# EAGLE design w10-output (EAGLE 8.4.0)
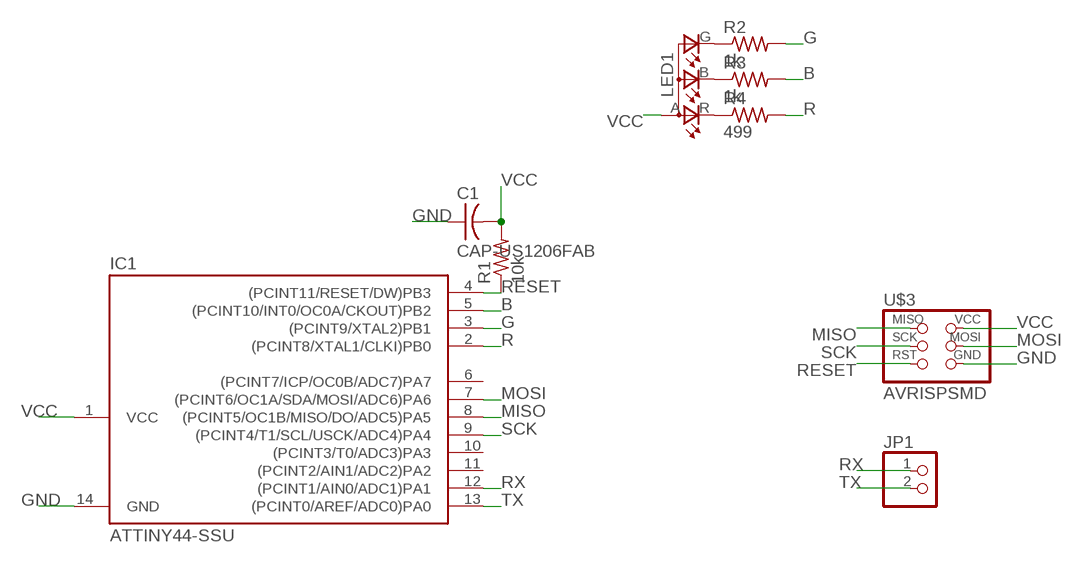
[diagram p0: schematic, sheet 1]

## Parts
C1  CAP-US1206FAB  [C1206FAB]
IC1  ATTINY44-SSU  [SOIC14]
JP1  PINHD-1X2  [1X02]
LED1  LEDRGBOLD  [P-LCC-4-3]
R1  10k  RES-US1206FAB  [R1206FAB]
R2  1k  RES-US1206FAB  [R1206FAB]
R3  1k  RES-US1206FAB  [R1206FAB]
R4  499  RES-US1206FAB  [R1206FAB]
U$3  AVRISPSMD  [2X03SMD]

## Nets
B: IC1.5((PCINT10/INT0/OC0A/CKOUT)PB2) R3.2
G: IC1.3((PCINT9/XTAL2)PB1) R2.2
GND: C1.1 IC1.14(GND) U$3.6(GND)
MISO: IC1.8((PCINT5/OC1B/MISO/DO/ADC5)PA5) U$3.1(MISO)
MOSI: IC1.7((PCINT6/OC1A/SDA/MOSI/ADC6)PA6) U$3.4(MOSI)
N$2: LED1.G(CGREEN) R2.1
N$6: LED1.B(CBLUE) R3.1
N$7: LED1.R(CRED) R4.1
R: IC1.2((PCINT8/XTAL1/CLKI)PB0) R4.2
RESET: IC1.4((PCINT11/RESET/DW)PB3) R1.1 U$3.5(RST)
RX: IC1.12((PCINT1/AIN0/ADC1)PA1) JP1.1
SCK: IC1.9((PCINT4/T1/SCL/USCK/ADC4)PA4) U$3.3(SCK)
TX: IC1.13((PCINT0/AREF/ADC0)PA0) JP1.2
VCC: C1.2 IC1.1(VCC) LED1.A(A2) R1.2 U$3.2(VCC)
Unconnected: IC1.6((PCINT7/ICP/OC0B/ADC7)PA7) IC1.10((PCINT3/T0/ADC3)PA3) IC1.11((PCINT2/AIN1/ADC2)PA2)

## Library data of the parts
C1 = fab:CAP-US
IC1 = fab:ATTINY44
JP1 = pinhead:PINHD-1X2: PIN HEADER
LED1 = fab:LEDRGBOLD: OSRAM Hyper Multi TOPLED® Hyper-Bright LED LATB T686 Source: http://www.osram.convergy.de/
R1-R4 = fab:RES-US: Resistor (US Symbol) Variants with postfix FAB are widened to allow the routing of internal traces
U$3 = fab:AVRISP

## Net classes
0 default: width 0.1 mm, clearance 0.5 mm

## Board
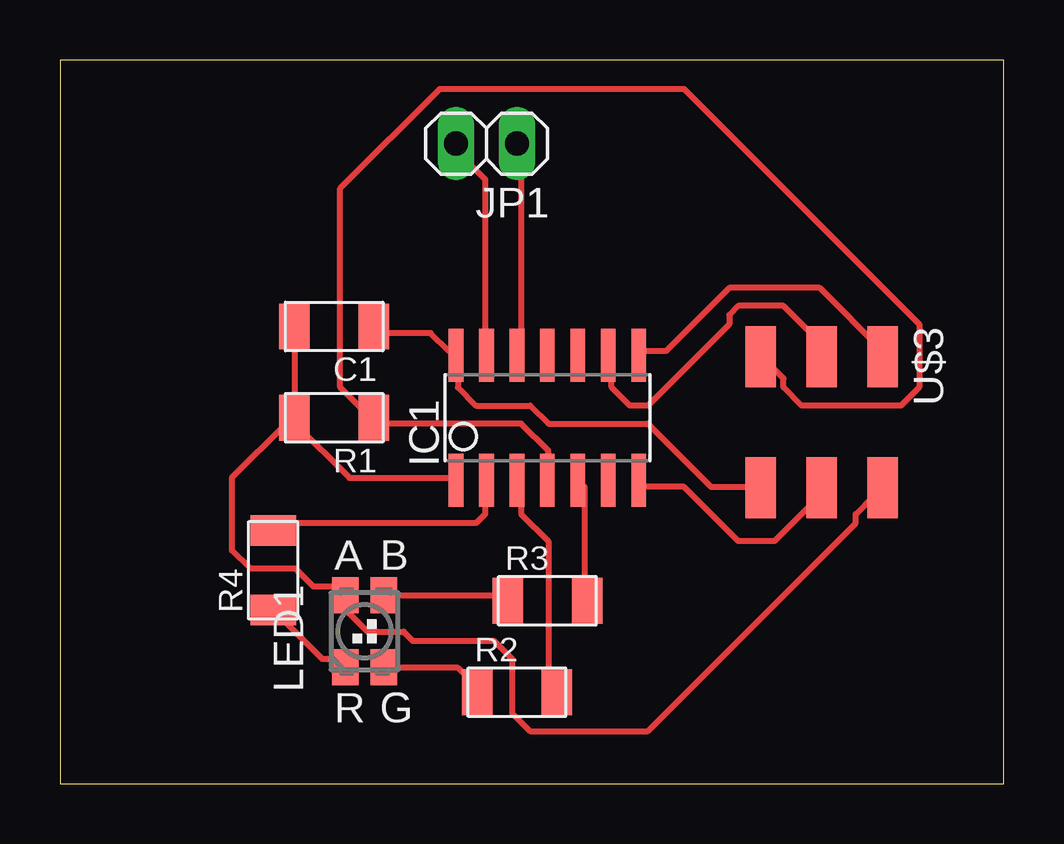
[diagram p1: board, top side]

Size 39.35 x 30.15 mm. Coordinates in mm from the lower left corner, seen from the top.
Outline: 0,0 39.35,0 39.35,30.15 0,30.15 0,0
Copper layers (1*16): Top 0.035mm / dielectric 1.5mm / Bottom 0.035mm
Design rules "fabmodule": minimum track width 10mil, minimum drill 0.4mm, track to track 0.42mm, track to pad 0.42mm, pad to pad 0.42mm, via to via 0.42mm, smd to smd 0.42mm, copper to edge 40mil, drill to drill 0.8mm, minimum pad ring 10mil, minimum via ring 8mil, stop-mask expansion 4mil, vias tented up to drill 0mil, thermal gap 10mil

### Footprints (pad centres in the part's own frame; a part is rotated, then mirrored left to right if it is on the bottom)
C1206FAB = smd 1.27 x 1.905: 1 -1.651,0; 2 1.651,0
SOIC14 = smd 0.61 x 2.21: 1 -3.81,-2.603; 2 -2.54,-2.603; 3 -1.27,-2.603; 4 0,-2.603; 5 1.27,-2.603; 6 2.54,-2.603; 7 3.81,-2.603; 8 3.81,2.603; 9 2.54,2.603; 10 1.27,2.603; 11 0,2.603; 12 -1.27,2.603; 13 -2.54,2.603; 14 -3.81,2.603
1X02 = drill 1.016 long: 1 -1.27,0; 2 1.27,0
P-LCC-4-3 = smd 1.1 x 1.5: A -0.8,1.5; B 0.8,1.5; G 0.8,-1.5; R -0.8,-1.5
R1206FAB = smd 1.27 x 1.905: 1 -1.651,0; 2 1.651,0
2X03SMD = smd 2.54 x 1.27: 1 -2.54,2.54; 2 2.92,2.54; 3 -2.54,0; 4 2.92,0; 5 -2.54,-2.54; 6 2.92,-2.54

### Placement (x,y rotation side)
C1  11.43,19.05 180 top
IC1  20.32,15.24 0 top
JP1  17.78,26.67 180 top
LED1  12.7,6.35 0 top
R1  11.43,15.24 180 top
R2  19.05,3.81 0 top
R3  20.32,7.62 0 top
R4  8.89,8.89 90 top
U$3  31.75,15.24 270 top

### Tracks (layer width: path | path; a pad name or v marks a point on that pad's centre or on a via)
B
  Top 0.254: R3.2 21.87,7.84 21.87,12.36 IC1.5
G
  Top 0.254: R2.2 20.36,4.07 20.36,10.1 19.23,11.23 19.23,12.36 IC1.3
GND
  Top 0.254: C1.1 13.2,18.77 15.46,18.77 16.21,18.02 IC1.14 16.59,17.64 16.59,16.51 17.34,15.75 19.6,15.75 20.36,15 24.5,15 27.14,12.36 29.03,12.36 U$3.6
MISO
  Top 0.254: IC1.8 24.13,18.02 25.26,18.02 27.9,20.65 31.67,20.65 34.31,18.02 U$3.1
MOSI
  Top 0.254: IC1.7 24.13,12.36 26.01,12.36 28.27,10.1 29.78,10.1 31.67,11.98 U$3.4
N$2
  Top 0.254: LED1.G 13.57,4.82 16.59,4.82 17.34,4.07 R2.1
N$6
  Top 0.254: LED1.B 13.57,7.84 18.47,7.84 R3.1
N$7
  Top 0.254: LED1.R 11.69,5.2 10.93,5.2 9.05,7.08 R4.1
R
  Top 0.254: R4.2 9.05,10.85 17.34,10.85 17.72,11.23 17.72,12.36 IC1.2
RESET
  Top 0.254: IC1.4 20.36,12.74 20.36,13.87 19.23,15 13.2,15 R1.1 12.82,15.38 11.69,16.51 11.69,24.8 15.83,28.95 26.01,28.95 35.81,19.15 35.81,16.51 35.06,15.75 30.91,15.75 30.16,16.51 30.16,16.88 29.41,17.64 U$3.5
RX
  Top 0.254: IC1.12 19.23,18.02 19.23,26.31 JP1.1
SCK
  Top 0.254: IC1.9 23,17.64 23,16.51 23.75,15.75 24.5,15.75 27.9,19.15 27.9,19.52 28.27,19.9 30.16,19.9 32.05,18.02 U$3.3
TX
  Top 0.254: IC1.13 17.72,18.02 17.72,25.18 16.59,26.31 JP1.2
VCC
  Top 0.254: R1.2 9.43,15 7.16,12.74 7.16,9.72 7.92,8.97 9.8,8.97 10.56,8.21 11.69,8.21 LED1.A 12.06,7.84 12.06,7.08 12.82,6.33 14.33,6.33 14.7,5.95 18.1,5.95 18.85,5.2 18.85,2.94 19.6,2.18 24.5,2.18 33.18,10.85 33.18,11.23 33.93,11.98 U$3.2 | C1.2 9.8,18.77 9.8,15.38 R1.2 | IC1.1 16.21,12.74 12.06,12.74 9.8,15 R1.2